# EAGLE design Base (EAGLE 7.1.0)
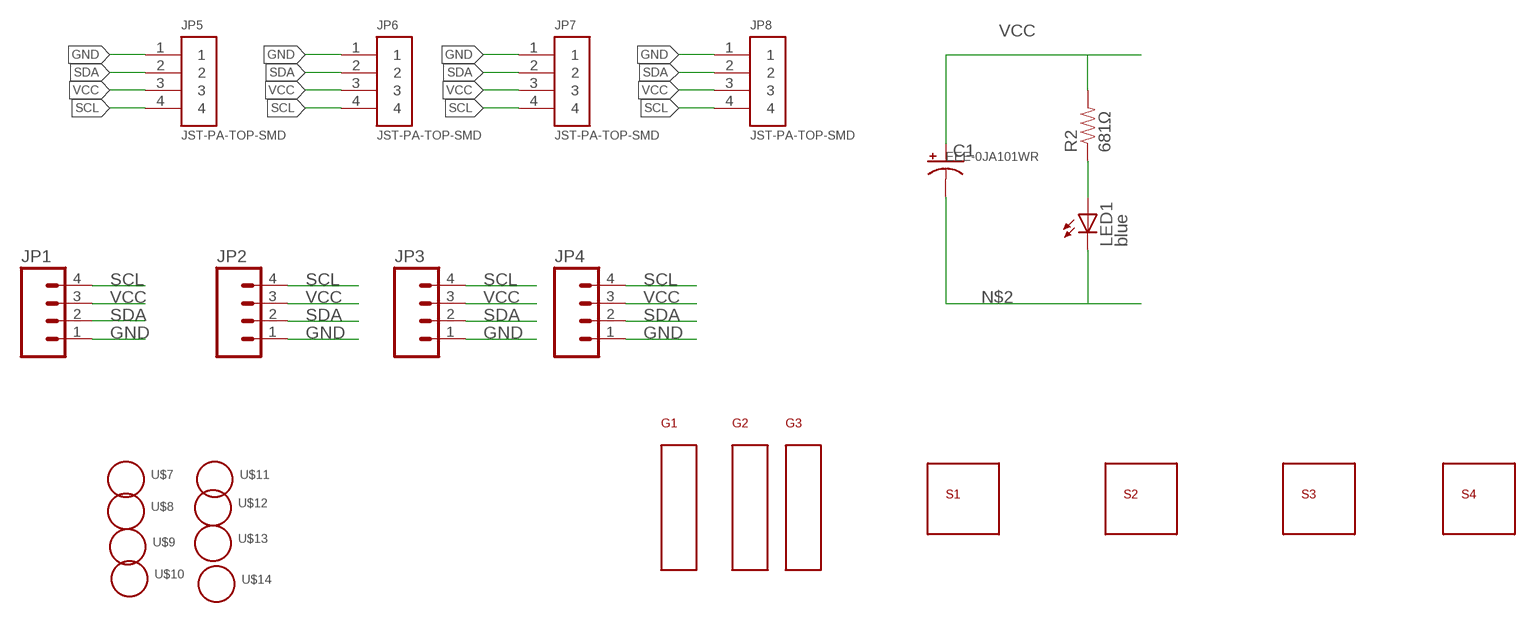
[diagram p0: schematic, sheet 1]

## Parts
C1  CAP_POLC  [PANASONIC_C]
G1  CARD-GUIDE  [CARD-GUIDE-2"]
G2  CARD-GUIDE  [CARD-GUIDE-2"]
G3  CARD-GUIDE  [CARD-GUIDE-2"]
JP1  M04LOCK  [1X04_LOCK]
JP2  M04LOCK  [1X04_LOCK]
JP3  M04LOCK  [1X04_LOCK]
JP4  M04LOCK  [1X04_LOCK]
JP5  JST-PA-TOP-SMD  [JST-PA-TOP-SMD]
JP6  JST-PA-TOP-SMD  [JST-PA-TOP-SMD]
JP7  JST-PA-TOP-SMD  [JST-PA-TOP-SMD]
JP8  JST-PA-TOP-SMD  [JST-PA-TOP-SMD]
LED1  blue  LED-0805-BLUE  [0805-LED]
R2  681Ω  RESISTOR-681Ω  [0603]
S1  SPACER  [SPACER]
S2  SPACER  [SPACER]
S3  SPACER  [SPACER]
S4  SPACER  [SPACER]
U$7  HOLE#2  [HOLE-#2]
U$8  HOLE#2  [HOLE-#2]
U$9  HOLE#2  [HOLE-#2]
U$10  HOLE#2  [HOLE-#2]
U$11  HOLE#2  [HOLE-#2]
U$12  HOLE#2  [HOLE-#2]
U$13  HOLE#2  [HOLE-#2]
U$14  HOLE#2  [HOLE-#2]

## Nets
GND: JP1.1 JP2.1 JP3.1 JP4.1 JP5.1 JP6.1 JP7.1 JP8.1
N$2: C1.- LED1.C
N$8: LED1.A R2.1
SCL: JP1.4 JP2.4 JP3.4 JP4.4 JP5.4 JP6.4 JP7.4 JP8.4
SDA: JP1.2 JP2.2 JP3.2 JP4.2 JP5.2 JP6.2 JP7.2 JP8.2
VCC: C1.+ JP1.3 JP2.3 JP3.3 JP4.3 JP5.3 JP6.3 JP7.3 JP8.3 R2.2
Unconnected: U$7.P$1(HOLE) U$8.P$1(HOLE) U$9.P$1(HOLE) U$10.P$1(HOLE) U$11.P$1(HOLE) U$12.P$1(HOLE) U$13.P$1(HOLE) U$14.P$1(HOLE)

## Library data of the parts
C1 = SparkFun-Capacitors:CAP_POL: Capacitor Polarized These are standard SMD and PTH capacitors. Normally 10uF, 47uF, and 100uF in electrolytic and tantalum varieties. Always verify the external diameter of the through hole cap, it varies with capacity, voltage, and manufacturer. The EIA devices should be standard.; PARTNUM: EEE-0JA101WR
G1 G3 = Modulo:CARD-GUIDE; PARTNUM: HCG-201-165
G2 = Modulo:CARD-GUIDE; PARTNUM: HCG-202-165
JP1-JP4 = SparkFun-Connectors:M04: Header 4 Standard 4-pin 0.1" header. Use with straight break away headers (SKU : PRT-00116), right angle break away headers (PRT-00553), swiss pins (PRT-00743), machine pins (PRT-00117), and female headers (PRT-00115). Molex polarized connector foot print use with SKU : PRT-08231 with associated crimp pins and housings. 1MM SMD Version SKU: PRT-10208; PARTNUM: PPTC041LGBN-RC
JP5-JP8 = Modulo:JST-PA; PARTNUM: BM04B-PASS-1-TFT(LF)(SN)
LED1 = Modulo:LED: LED; PARTNUM: LTST-C171TBKT
R2 = Modulo:RESISTOR: Resistor Basic schematic elements and footprints for 0603, 1206, and PTH resistors.; PARTNUM: ERJ-3EKF6810V
S1-S4 = Modulo:SPACER
U$7-U$14 = Modulo:HOLE; PARTNUM: EXCLUDE

## Board
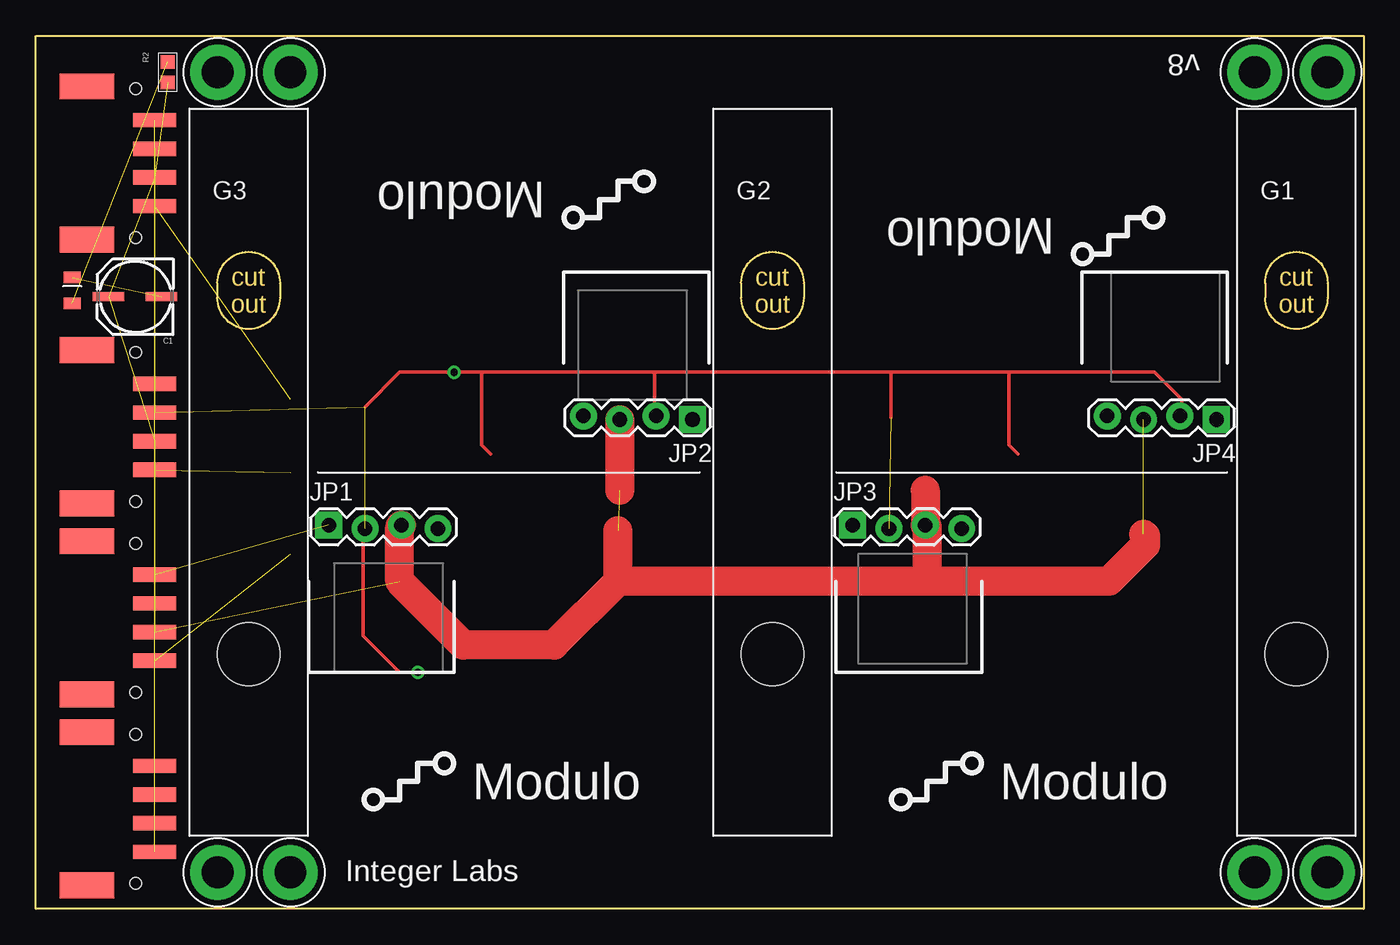
[diagram p1: board, top side]
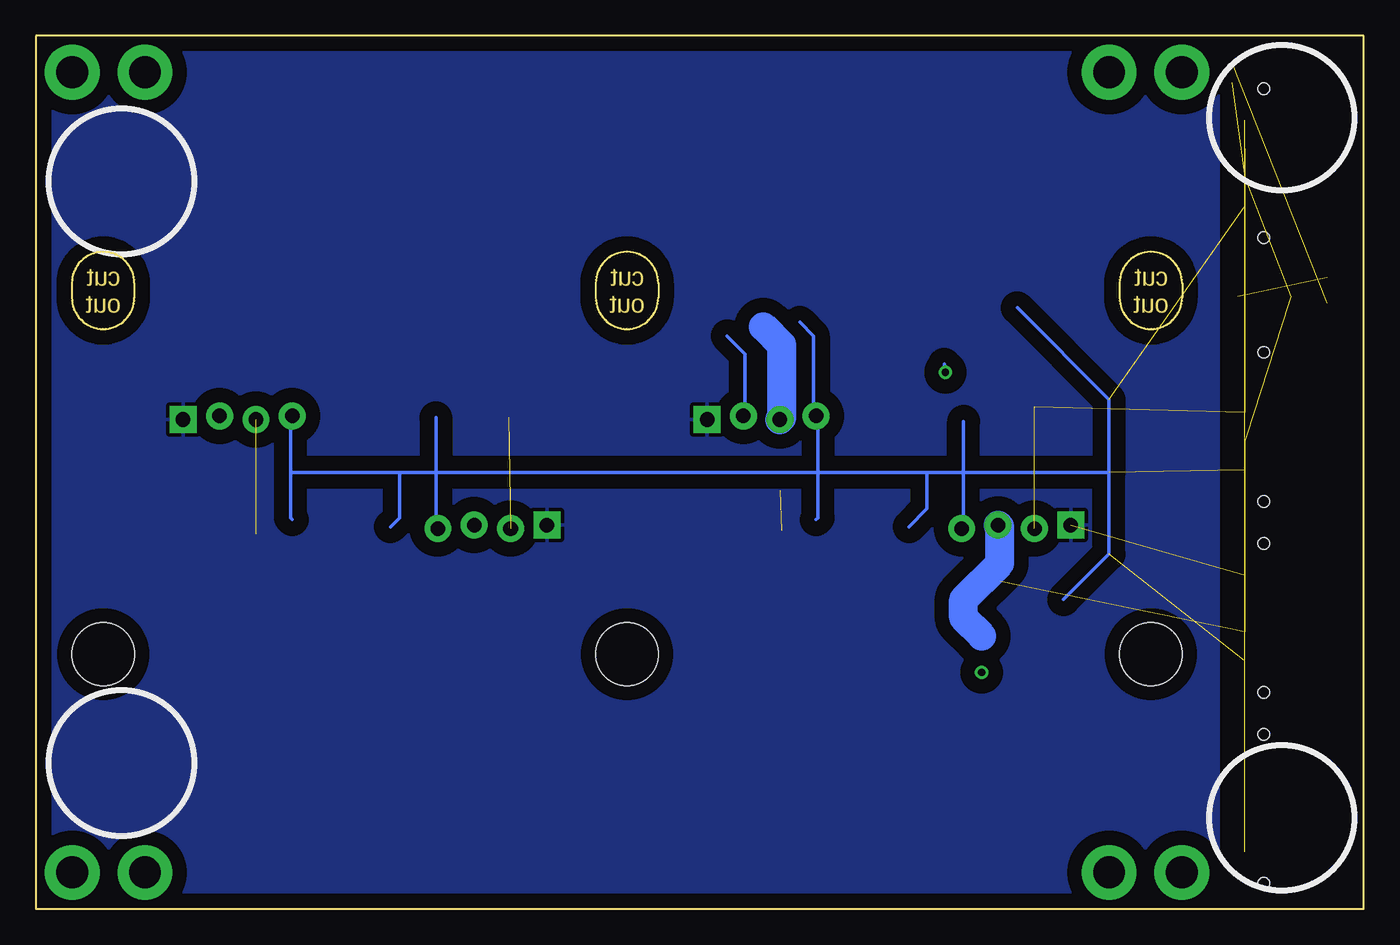
[diagram p2: board, bottom side, seen from below]

Size 92.71 x 60.96 mm. Coordinates in mm from the lower left corner, seen from the top.
Outline: 0,0 0,60.96 92.71,60.96 92.71,0 0,0
Copper layers (1*16): Top 0.0178mm / dielectric 59mil / Bottom 0.0178mm
Design rules "SSC-EAGLE-2Lyr_v1.0.0.3 *": minimum track width 6mil, minimum drill 14mil, track to track 6mil, track to pad 6mil, pad to pad 6mil, via to via 6mil, smd to smd 6mil, copper to edge 20mil, drill to drill 16mil, minimum pad ring 8mil, minimum via ring 8mil, stop-mask expansion 3mil, vias tented up to drill 25mil, thermal gap 10mil

### Footprints (pad centres in the part's own frame; a part is rotated, then mirrored left to right if it is on the bottom)
PANASONIC_C = smd 2.2 x 0.65: + 1.9,-0.2; - -1.8,-0.2
CARD-GUIDE-2" = hole 4.369: 0,-12.7
1X04_LOCK = drill 1.016 pad 1.88 square: 1 0,0.127 | drill 1.016 pad 1.88: 2 2.54,-0.127; 3 5.08,0.127; 4 7.62,-0.127
JST-PA-TOP-SMD = smd 1 x 3: 1 -3,1.3; 2 -1,1.3; 3 1,1.3; 4 3,1.3 | smd 1.8 x 3.8: R1 -5.35,-3.4; R2 5.35,-3.4 | hole 0.8: 5.2,0; -5.2,0
0805-LED = smd 1.2 x 0.8: A 0,-0.9; C 0,0.9
0603 = smd 0.95 x 0.95: 1 -0.725,0; 2 0.725,0
HOLE-#2 = drill 2.223 pad 3.81: P$1 0,0

### Placement (x,y rotation side)
C1  6.99,42.55 180 top
G1  88.01,30.48 0 top
G2  51.44,30.48 0 top
G3  14.86,30.48 0 top
JP1  20.45,26.67 0 top
JP2  45.85,34.29 180 top
JP3  57.02,26.67 0 top
JP4  82.42,34.29 180 top
JP5  6.99,33.66 270 top
JP6  6.99,20.32 270 top
JP7  6.99,6.99 270 top
JP8  6.99,52.07 270 top
LED1  2.54,43.18 0 top
R2  9.21,58.42 270 top
S1  24.64,20.32 0 top
S2  41.66,39.37 0 top
S3  61.21,20.95 0 top
S4  78.87,40.64 0 top
U$7  12.7,2.54 0 top
U$8  85.09,58.42 0 top
U$9  85.09,2.54 0 top
U$10  17.78,2.54 0 top
U$11  12.7,58.42 0 top
U$12  90.17,58.42 0 top
U$13  17.78,58.42 0 top
U$14  90.17,2.54 0 top

### Tracks (layer width: path | path; a pad name or v marks a point on that pad's centre or on a via)
GND  (4 unrouted)
  pour Bottom (isolate 1.016): 10.16,0 10.16,60.96 92.71,60.96 92.71,0
N$2  (1 unrouted)
N$8  (1 unrouted)
SCL  (4 unrouted)
  Bottom 0.254: 27.94,30.48 30.48,30.48 | 30.48,30.48 38.1,30.48 | 38.1,30.48 64.77,30.48 | 64.77,30.48 67.31,30.48 | 67.31,30.48 74.93,30.48 | 74.93,30.48 74.93,34.54 JP4.4 | 64.77,34.29 64.77,30.48 | 38.1,30.48 38.1,34.54 JP2.4 38.42,35.18 38.42,40.01 39.37,40.96 | 27.94,30.48 27.94,34.04 | JP1.4 27.94,26.67 27.94,30.48 | 74.8,27.18 74.93,27.3 74.93,30.48 | JP3.4 64.77,26.67 64.77,30.48 | 38.23,27.18 38.1,27.3 38.1,30.48 | 17.78,30.48 27.94,30.48 | 24.19,41.97 17.78,35.56 17.78,30.48 | 31.75,26.67 30.48,27.94 30.48,30.48 | 67.94,26.67 67.31,27.3 67.31,30.48 | 20.96,21.59 17.78,24.77 17.78,30.48
SDA  (via drill 0.51)  (6 unrouted)
  Top 0.254: 22.99,35.05 25.4,37.47 v29.21,37.47 31.12,37.47 | 31.12,37.47 43.18,37.47 | 43.18,37.47 59.69,37.47 | 59.69,37.47 67.94,37.47 | 67.94,37.47 78.1,37.47 80.01,35.56 80.01,34.54 JP4.2 | 59.69,37.47 59.69,34.29 | 43.18,37.47 43.18,34.54 JP2.2 | 68.58,31.75 67.94,32.38 67.94,37.47 | 31.75,31.75 31.12,32.38 31.12,37.47 | v26.67,16.51 25.4,16.51 22.86,19.05 22.86,26.42 JP1.2
  Bottom 0.254: 29.27,38.04 v29.21,37.47 | 44.45,40.01 43.18,38.73 43.18,34.54 JP2.2
VCC  (8 unrouted)
  Top 2.032: 62.23,22.86 74.93,22.86 77.47,25.4 77.47,26.04 77.34,26.16 | 62.23,22.86 40.64,22.86 | 40.64,22.86 36.2,18.41 29.84,18.41 25.4,22.86 25.4,26.67 JP1.3 | 62.1,29.21 JP3.3 62.23,26.67 62.23,22.86 | JP2.3 40.77,29.21 | 40.64,22.86 40.64,26.42
  Bottom 2.032: 41.91,40.64 40.64,39.37 40.64,34.29 JP2.3 | 26.67,19.05 27.94,20.32 27.94,21.59 25.4,24.13 25.4,26.67 JP1.3

### Text on the board
tPlace: v8 | Modulo | Modulo | Modulo | Modulo | Integer Labs